# EAGLE schematic 001_full_version (EAGLE 9.5.2)
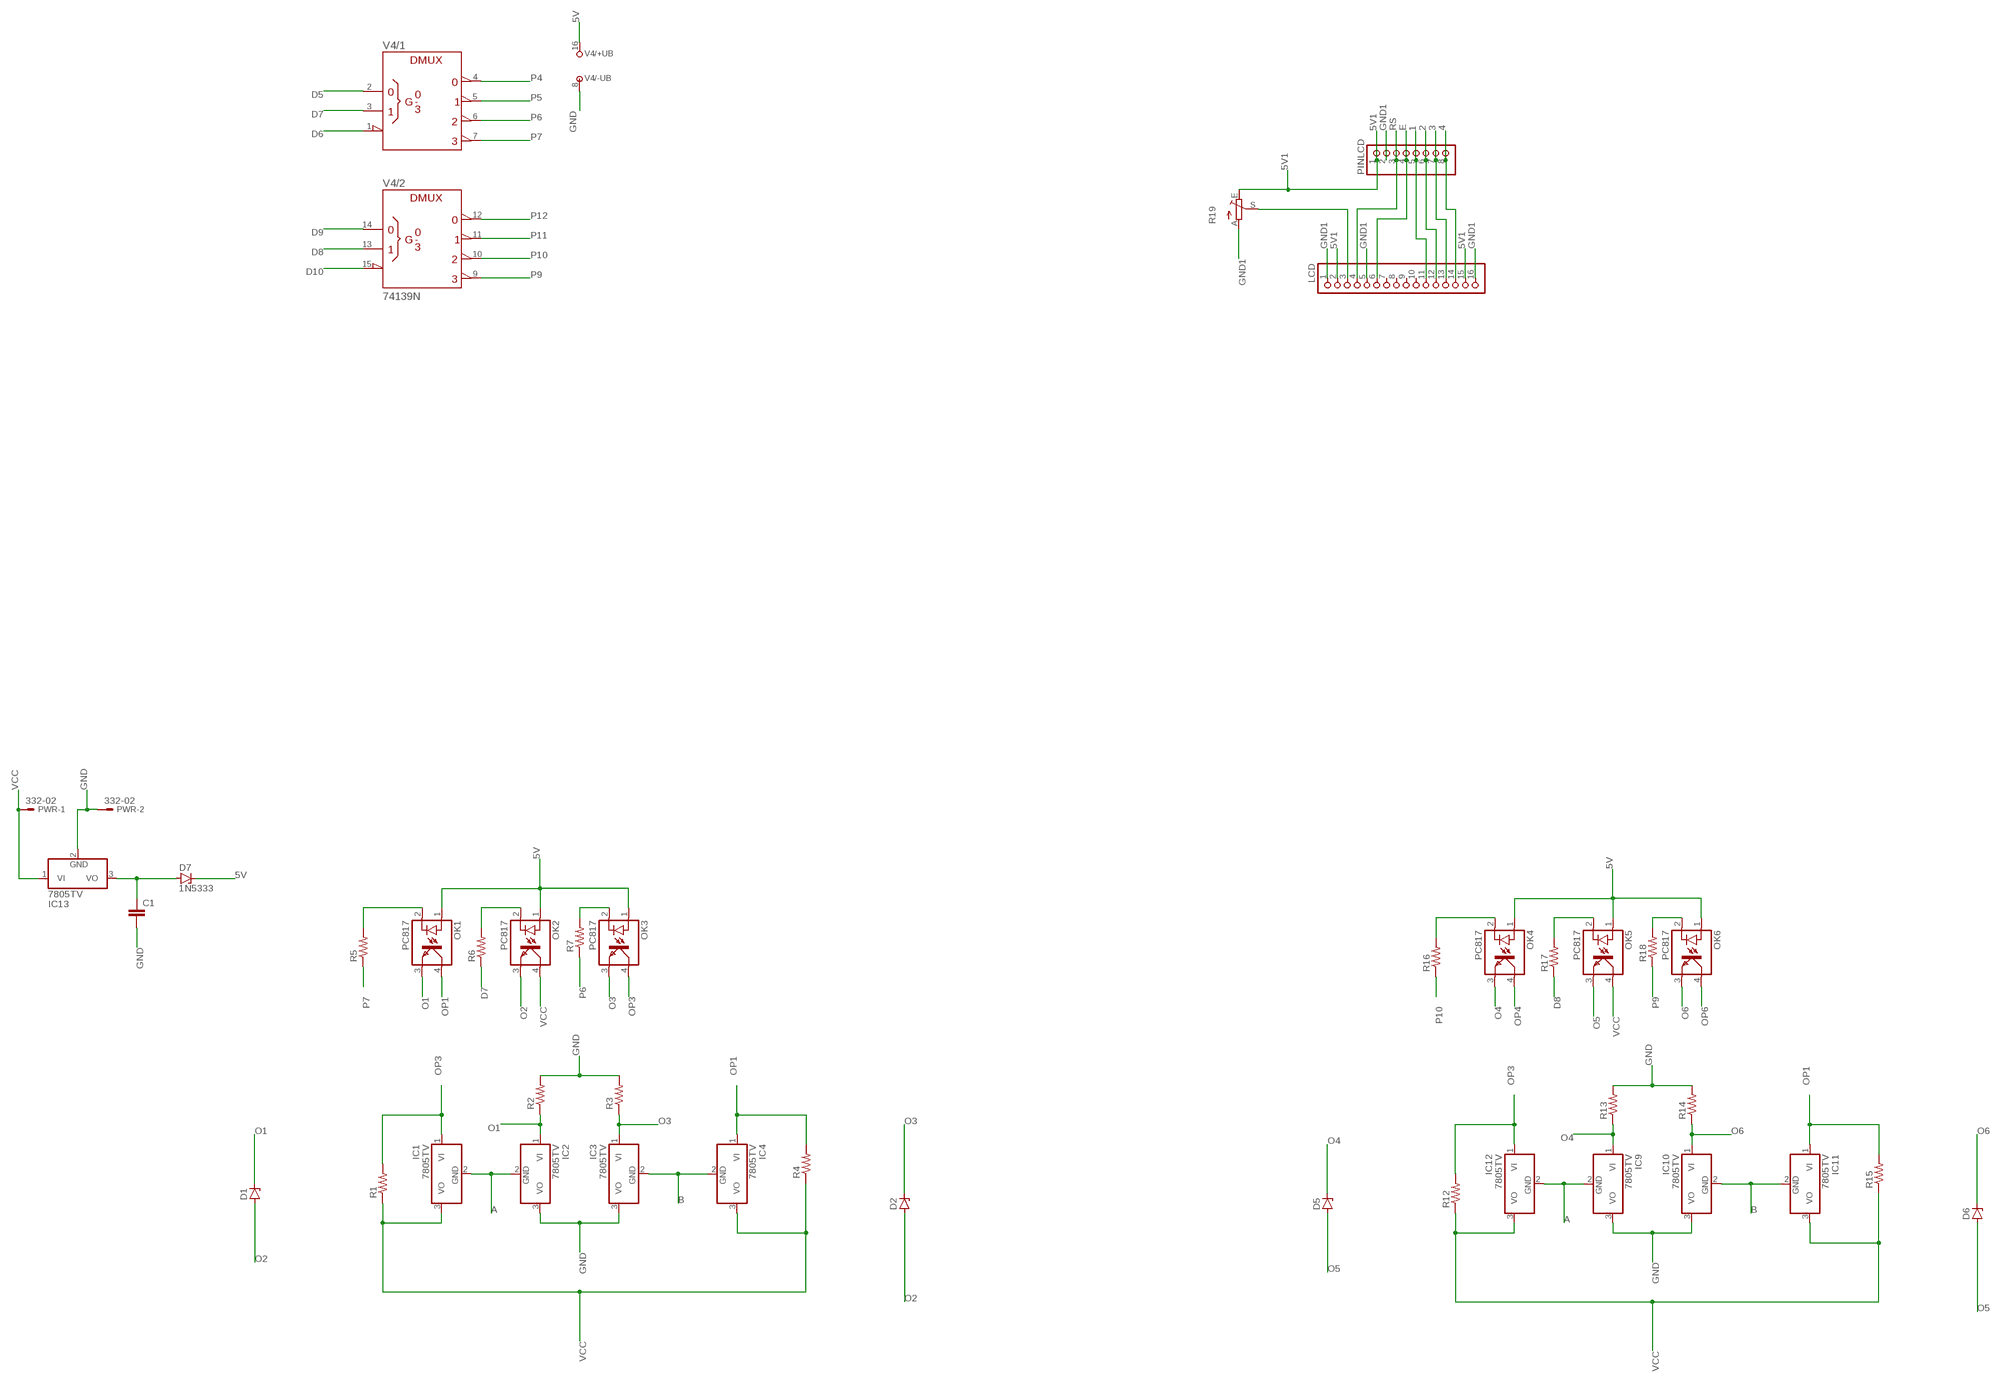
[diagram p0: schematic, sheet 1]

## Parts
C1  C2,5-3  [C2.5-3]
D1  ZENER-DIODEDO41Z10  [DO41Z10]
D2  ZENER-DIODEDO41Z10  [DO41Z10]
D5  ZENER-DIODEDO41Z10  [DO41Z10]
D6  ZENER-DIODEDO41Z10  [DO41Z10]
D7  1N5333  [C1702-15]
IC1  7805TV  [TO220V]
IC2  7805TV  [TO220V]
IC3  7805TV  [TO220V]
IC4  7805TV  [TO220V]
IC9  7805TV  [TO220V]
IC10  7805TV  [TO220V]
IC11  7805TV  [TO220V]
IC12  7805TV  [TO220V]
IC13  7805TV  [TO220V]
LCD  PINHD-1X16  [1X16]
OK1  PC817  [DIL04]
OK2  PC817  [DIL04]
OK3  PC817  [DIL04]
OK4  PC817  [DIL04]
OK5  PC817  [DIL04]
OK6  PC817  [DIL04]
PINLCD  PINHD-1X8  [1X08]
PWR  332-02  [332-02]
R1  R-US_M0805  [M0805]
R2  R-US_M0805  [M0805]
R3  R-US_M0805  [M0805]
R4  R-US_M0805  [M0805]
R5  R-US_M0805  [M0805]
R6  R-US_M0805  [M0805]
R7  R-US_M0805  [M0805]
R12  R-US_M0805  [M0805]
R13  R-US_M0805  [M0805]
R14  R-US_M0805  [M0805]
R15  R-US_M0805  [M0805]
R16  R-US_M0805  [M0805]
R17  R-US_M0805  [M0805]
R18  R-US_M0805  [M0805]
R19  TRIM_EU-B25U  [B25U]
V4  74139N  [DIL16]

## Nets
1: LCD.11 PINLCD.5
2: LCD.12 PINLCD.6
3: LCD.13 PINLCD.7
4: LCD.14 PINLCD.8
5V: D7.C OK1.1(A) OK2.1(A) OK3.1(A) OK4.1(A) OK5.1(A) OK6.1(A) V4.16(/+UB:+UB)
5V1: LCD.2 LCD.15 PINLCD.1 R19.E
A: IC1.2(GND) IC2.2(GND) IC9.2(GND) IC12.2(GND)
B: IC3.2(GND) IC4.2(GND) IC10.2(GND) IC11.2(GND)
D5: V4.2(/1:A)
D6: V4.1(/1:!G)
D7: R6.1 V4.3(/1:B)
D8: R17.1 V4.13(/2:B)
D9: V4.14(/2:A)
D10: V4.15(/2:!G)
E: LCD.6 PINLCD.4
GND: C1.2 IC2.3(VO) IC3.3(VO) IC9.3(VO) IC10.3(VO) IC13.2(GND) PWR.2 R2.2 R3.2 R13.2 R14.2 V4.8(/-UB:-UB)
GND1: LCD.1 LCD.5 LCD.16 PINLCD.2 R19.A
N$2: OK4.2(C) R16.2
N$4: OK5.2(C) R17.2
N$5: OK6.2(C) R18.2
N$7: LCD.3 R19.S
N$8: C1.1 D7.A IC13.3(VO)
N$9: OK1.2(C) R5.2
N$10: OK2.2(C) R6.2
N$11: OK3.2(C) R7.2
O1: D1.C IC2.1(VI) OK1.3(EMIT) R2.1
O2: D1.A D2.A OK2.3(EMIT)
O3: D2.C IC3.1(VI) OK3.3(EMIT) R3.1
O4: D5.C IC9.1(VI) OK4.3(EMIT) R13.1
O5: D5.A D6.A OK5.3(EMIT)
O6: D6.C IC10.1(VI) OK6.3(EMIT) R14.1
OP1: IC4.1(VI) IC11.1(VI) OK1.4(COL) R4.2 R15.2
OP3: IC1.1(VI) IC12.1(VI) OK3.4(COL) R1.2 R12.2
OP4: OK4.4(COL)
OP6: OK6.4(COL)
P4: V4.4(/1:Y0)
P5: V4.5(/1:Y1)
P6: R7.1 V4.6(/1:Y2)
P7: R5.1 V4.7(/1:Y3)
P9: R18.1 V4.9(/2:Y3)
P10: R16.1 V4.10(/2:Y2)
P11: V4.11(/2:Y1)
P12: V4.12(/2:Y0)
RS: LCD.4 PINLCD.3
VCC: IC1.3(VO) IC4.3(VO) IC11.3(VO) IC12.3(VO) IC13.1(VI) OK2.4(COL) OK5.4(COL) PWR.1 R1.1 R4.1 R12.1 R15.1
Unconnected: LCD.7 LCD.8 LCD.9 LCD.10

## Library data of the parts
C1 = capacitor-wima:C: CAPACITOR naming: grid - package width
D1 D2 D5 D6 = diode:ZENER-DIODE: Z-Diode
D7 = diode:1N5333: Z DIODE 3.3 V, 5W, 5 percent (Motorola)
IC1-IC4 IC9-IC13 = linear:78*: Positive VOLTAGE REGULATOR Source: http://cache.national.com/ds/LM/LM78L05.pdf http://www.fairchildsemi.com/ds/LM/LM7805.pdf
LCD = pinhead:PINHD-1X16: PIN HEADER
OK1-OK6 = optocoupler:PC817: SHARP OPTO COUPLER; MPN: PC817X4J000F; OC_FARNELL: 9707727; OC_NEWARK: 97K7059
PINLCD = pinhead:PINHD-1X8: PIN HEADER
PWR = con-garry:332-02: 2 Pin - 2mm Dual Row Source: www.mpe-connector.de / garry_shortform_2012.pdf
R1-R7 R12-R18 = rcl:R-US_: RESISTOR, American symbol; SPICEPREFIX: R
R19 = pot:TRIM_EU-: POTENTIOMETER
V4 = 74ttl-din:74*139: Dual 2-line to 4-line DECODER/DEMULTIPLEXER